# Altium schematic sheet Microphone amplifier.SchDoc
size A4
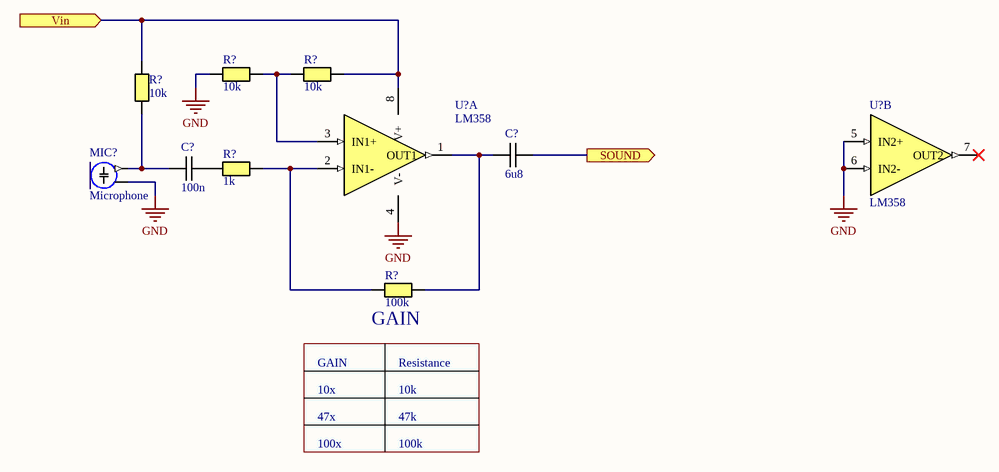
[diagram p0: Microphone amplifier.SchDoc]

## Parts
(Parts that share a designator on the sheet are numbered #1, #2 ... from top to bottom, then left to right.)
C?#1  6u8  [CAPC0805(2012)75_N]
C?#2  100n  [CAPC0603(1608)55_N]
MIC?  Microphone  [Microphone]
R?#1  10k  [RESC0603(1608)_N]
R?#2  10k  [RESC0603(1608)_N]
R?#3  10k  [RESC0603(1608)_N]
R?#4  1k  [RESC0603(1608)_N]
R?#5  100k  [RESC0603(1608)_N]
U?#1  LM358  [SO8]  (part A of 2)
U?#2  LM358  [SO8]  (part B of 2)

## Ports
SOUND (out), Vin (in)

## Nets
GND: MIC?.1(GND) R?#1.2 U?#1.4(V-) U?#2.5(IN2+) U?#2.6(IN2-)
SOUND: C?#1.2 ; port SOUND
Vin: R?#2.1 R?#3.2 U?#1.8(V+) ; port Vin
NetC?#1_1: C?#1.1 R?#5.2 U?#1.1(OUT1)
NetC?#2_1: C?#2.1 MIC?.0(OUT) R?#3.1
NetC?#2_2: C?#2.2 R?#4.1
NetR?#1_1: R?#1.1 R?#2.2 U?#1.3(IN1+)
NetR?#4_2: R?#4.2 R?#5.1 U?#1.2(IN1-)

Not connected (* = marked no-connect by the designer): U?#2 7(OUT2)*

## Notes on the sheet
- GAIN
- (near R?#5) GAIN
- Resistance
- 10x
- 47x
- 100x
- 10k
- 47k
- 100k

## Library data of the parts
C?#1 C?#2 = Capacitor M: Ceramic capacitor Medium density
  C?#1: Value: 6u8
  C?#2: Value: 100n
MIC? = Mini MIC Capsule Electret Condenser Microphone: Mini MIC Capsule Electret Condenser
R?#1-R?#5 = Resistor M: Resistor Medium Density
  R?#1-R?#3: Value: 10k
  R?#4: Value: 1k
  R?#5: Value: 100k